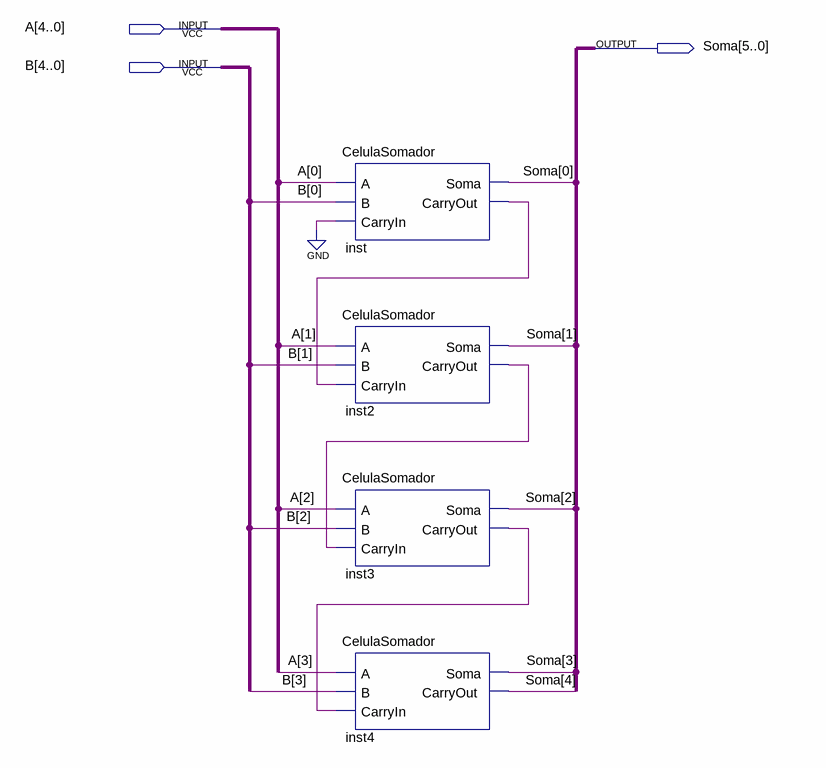
[diagram p0: schematic sheet]
// Quartus schematic SomadorCompleto.bdf as structural Verilog: 4 symbols, 3 pins
module SomadorCompleto (
  input  [4:0] A,
  input  [4:0] B,
  output [5:0] Soma
);

  wire inst2_carryout, inst3_carryout, inst_carryout;

  CelulaSomador inst (.A(A[0]), .B(B[0]), .CarryIn(1'b0), .Soma(Soma[0]), .CarryOut(inst_carryout));
  CelulaSomador inst2 (.A(A[1]), .B(B[1]), .CarryIn(inst_carryout), .Soma(Soma[1]), .CarryOut(inst2_carryout));
  CelulaSomador inst3 (.A(A[2]), .B(B[2]), .CarryIn(inst2_carryout), .Soma(Soma[2]), .CarryOut(inst3_carryout));
  CelulaSomador inst4 (.A(A[3]), .B(B[3]), .CarryIn(inst3_carryout), .Soma(Soma[3]), .CarryOut(Soma[4]));
endmodule
